# Altium project Proyecto_Receptaculo.PrjPcb
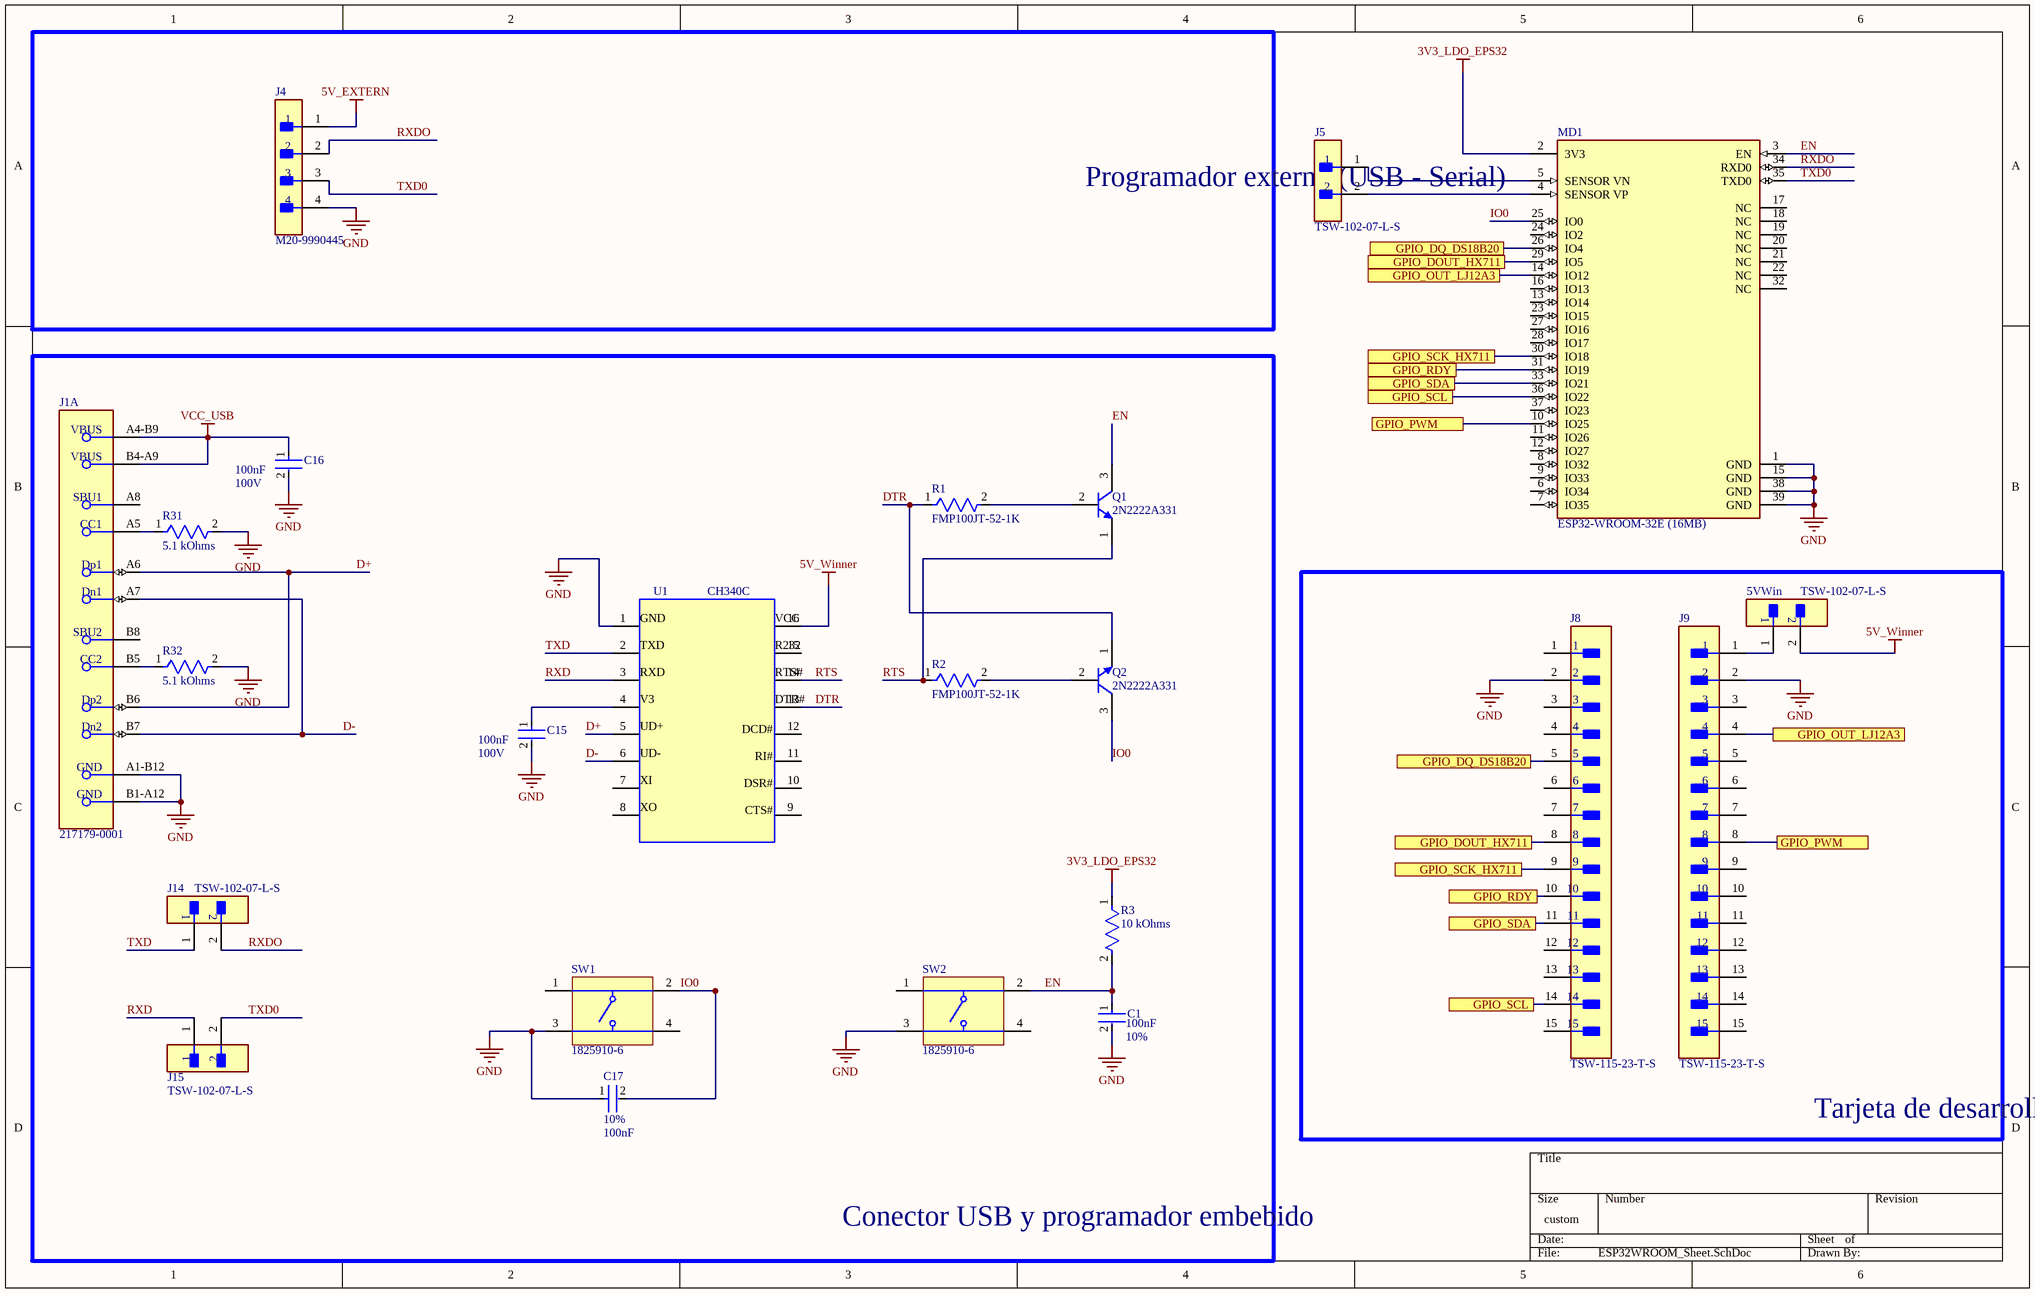
[diagram p0: ESP32WROOM_Sheet.SchDoc]
Title: Alimentacion
5 sheets, 103 parts. Net scope: flat (ports and power ports of the same name join across sheets).
Board file: Proyecto_receptaculo_PCB.PcbDoc
Sheets:
  ESP32WROOM_Sheet.SchDoc
  Alimentacion_Sheet.SchDoc
  Driver_Motor_Sheet.SchDoc
  Sensores_ADCs_Sheet.SchDoc
  Placa_Receptaculo_Gases_Sheet.SchDoc

## Sheet ESP32WROOM_Sheet.SchDoc: ESP32-WROOM-32
size 381 x 241 mm; DocumentNumber: 1; Revision: 1.0; SheetNumber: 1; SheetTotal: 5

### Parts
5VWin  TSW-102-07-L-S  [FP-TSW-102-07-L-S-MFG]
C1  Tolerance: 10%  Capacitance: 100nF  [FP-RDE2M1-MFG]  (hidden comment: RDER72E104K2K1H03B)
C15  Capacitance: 100nF  Voltage Rating (DC): 100V  [FP-RCE1K1-2_5-MFG]  (hidden comment: RCER72A104K1K1H03B)
C16  Capacitance: 100nF  Voltage Rating (DC): 100V  [FP-RCE1K1-2_5-MFG]  (hidden comment: RCER72A104K1K1H03B)
C17  Tolerance: 10%  Capacitance: 100nF  [FP-RDE2M1-MFG]  (hidden comment: RDER72E104K2K1H03B)
J1  217179-0001  [FP-2171790001-MFG]  (part A of 2)
J4  M20-9990445  [FP-M20-9990445-MFG]
J5  TSW-102-07-L-S  [FP-TSW-102-07-L-S-MFG]
J8  TSW-115-23-T-S  [FP-TSW-115-23-T-S-MFG]
J9  TSW-115-23-T-S  [FP-TSW-115-23-T-S-MFG]
J14  TSW-102-07-L-S  [FP-TSW-102-07-L-S-MFG]
J15  TSW-102-07-L-S  [FP-TSW-102-07-L-S-MFG]
MD1  ESP32-WROOM-32E (16MB)  [FP-ESP32-WROOM-32E_16MB-MFG]
Q1  2N2222A331  [TO-92]
Q2  2N2222A331  [TO-92]
R1  FMP100JT-52-1K  [FP-FMP100-MFG]
R2  FMP100JT-52-1K  [FP-FMP100-MFG]
R3  10 kOhms  [FP-FMP100-MFG]
R31  5.1 kOhms  [FP-FMP100-MFG]
R32  5.1 kOhms  [FP-FMP100-MFG]
SW1  1825910-6  [TECO-1825910-6_V]
SW2  1825910-6  [TECO-1825910-6_V]
U1  CH340C  [SOP-16 (SOP127P780X190-16N)]

### Blocks framed on the sheet
Programador externo (USB - Serial): J4
Conector USB y programador embebido: C1 C15-C17 J1 J14 J15 Q1 Q2 R1-R3 R31 R32 SW1 SW2 U1
Tarjeta de desarrollo externa: 5VWin J8 J9

### Ports
GPIO_DOUT_HX711 (see ESP32WROOM_Sheet[5A], Sensores_ADCs_Sheet[3C]), GPIO_DOUT_HX711 (see ESP32WROOM_Sheet[5C], Sensores_ADCs_Sheet[3C]), GPIO_DQ_DS18B20 (see ESP32WROOM_Sheet[5A], Sensores_ADCs_Sheet[4B]), GPIO_DQ_DS18B20 (see ESP32WROOM_Sheet[5C], Sensores_ADCs_Sheet[4B]), GPIO_OUT_LJ12A3 (see ESP32WROOM_Sheet[5A], Sensores_ADCs_Sheet[5B]), GPIO_OUT_LJ12A3 (see ESP32WROOM_Sheet[6C], Sensores_ADCs_Sheet[5B]), GPIO_PWM (see Driver_Motor_Sheet[1C], ESP32WROOM_Sheet[5B]), GPIO_PWM (see Driver_Motor_Sheet[1C], ESP32WROOM_Sheet[6C]), GPIO_RDY (see ESP32WROOM_Sheet[5B], Sensores_ADCs_Sheet[4B]), GPIO_RDY (see ESP32WROOM_Sheet[5C], Sensores_ADCs_Sheet[4B]), GPIO_SCK_HX711 (see ESP32WROOM_Sheet[5B], Sensores_ADCs_Sheet[3C]), GPIO_SCK_HX711 (see ESP32WROOM_Sheet[5C], Sensores_ADCs_Sheet[3C]), GPIO_SCL (see ESP32WROOM_Sheet[5B], Sensores_ADCs_Sheet[4A]), GPIO_SCL (see ESP32WROOM_Sheet[5D], Sensores_ADCs_Sheet[4A]), GPIO_SDA (see ESP32WROOM_Sheet[5B], Sensores_ADCs_Sheet[4A]), GPIO_SDA (see ESP32WROOM_Sheet[5C], Sensores_ADCs_Sheet[4A])

### Nets
3V3_LDO_EPS32: MD1.2(3V3) R3.1
5V_EXTERN: J4.1
5V_Winner: 5VWin.2 U1.16
GND: C1.2 C15.2 C16.2 C17.1 J1.A1-B12(GND) J1.B1-A12(GND) J4.4 J8.2 J9.2 MD1.1(GND) MD1.15(GND) MD1.38(GND) MD1.39(GND) R31.2 R32.2 SW1.3 SW2.3 U1.1
VCC_USB: C16.1 J1.A4-B9(VBUS) J1.B4-A9(VBUS)
D+: J1.A6(Dp1) J1.B6(Dp2) U1.5
D-: J1.A7(Dn1) J1.B7(Dn2) U1.6
DTR: Q2.1(E) R1.1 U1.13
EN: C1.1 MD1.3(EN) Q1.3(C) R3.2 SW2.2
IO0: C17.2 MD1.25(IO0) Q2.3(C) SW1.2
RTS: Q1.1(E) R2.1 U1.14
RXD: J15.1 U1.3
RXDO: J4.2 J14.2 MD1.34(RXD0)
TXD: J14.1 U1.2
TXD0: J4.3 J15.2 MD1.35(TXD0)
Net5VWin_1: 5VWin.1 J9.1
NetC15_1: C15.1 U1.4
NetJ1_A5: J1.A5(CC1) R31.1
NetJ1_B5: J1.B5(CC2) R32.1
NetJ5_1: J5.1 MD1.5(SENSOR_VN)
NetJ5_2: J5.2 MD1.4(SENSOR_VP)
NetJ8_5: J8.5 MD1.26(IO4) ; port GPIO_DQ_DS18B20
NetJ8_8: J8.8 MD1.29(IO5) ; port GPIO_DOUT_HX711
NetJ8_9: J8.9 MD1.30(IO18) ; port GPIO_SCK_HX711
NetJ8_10: J8.10 MD1.31(IO19) ; port GPIO_RDY
NetJ8_11: J8.11 MD1.33(IO21) ; port GPIO_SDA
NetJ8_14: J8.14 MD1.36(IO22) ; port GPIO_SCL
NetJ9_4: J9.4 MD1.14(IO12) ; port GPIO_OUT_LJ12A3
NetJ9_8: J9.8 MD1.10(IO25) ; port GPIO_PWM
NetQ1_2: Q1.2(B) R1.2
NetQ2_2: Q2.2(B) R2.2

Not connected (* = marked no-connect by the designer): J1 A8(SBU1) B8(SBU2); J8 1 3 4 6 7 12 13 15; J9 3 5 6 7 9 10 11 12 13 14 15; MD1 6(IO34) 7(IO35) 8(IO32) 9(IO33) 11(IO26) 12(IO27) 13(IO14) 16(IO13) 17(NC) 18(NC) 19(NC) 20(NC) 21(NC) 22(NC) 23(IO15) 24(IO2) 27(IO16) 28(IO17) 32(NC) 37(IO23); SW1 1 4; SW2 1 4; U1 7 8 9 10 11 12 15

### Notes on the sheet
- (in symbol CH340) GND; VCC; TXD; R232; RXD; RTS#; V3; DTR#; DCD#; UD+; RI#; UD-; DSR#; XI; CTS#; XO

### Library data of the parts
5VWin J5 J14 J15 = CMP-02766-001428-1: CONN HEADER VERT 2POS 2.54MM; Voltage Rating: 550V; Current Rating: 7.6A; Gender: Male; Number of Contacts: 2; Connector Type: Male Pin; Radiation Hardening: No; Orientation: Straight; Contact Plating: Gold; Max Operating Temperature: 125°C; Mount: Through Hole; Package Quantity: 1; Number of Rows: 1; Housing Material: Polyester; RoHS Compliant: Yes; Length: 5.08mm; Max Voltage Rating (AC): 550V; Pitch: 2.54mm; Packaging: Bulk; Depth: 2.54mm; Termination: Solder; Min Operating Temperature: -55°C; Housing Color: Black; Lead Free: Lead Free; Color: Black; Number of Positions: 2; Width: 2.54mm; Max Current Rating: 7.6A; REACH SVHC: No SVHC; Contact Material: Bronze; Contact Mating Length: 0.23inch; Series: TSW; Contact Type: Male Pin
C1 C17 = CMP-06035-020184-1: Ceramic Capacitor 100nF ±10% 250V X7R Radial; Lead/Base Style: Kinked; Lead Diameter: 0.5mm; Lead Pitch: 0.197inch; Dielectric: X7R; Mount: Through Hole; Resistor Type: Ceramic; Height: 4mm; Width: 0.124inch; Length: 5.5mm; Case/Package: Radial; Packaging: Bulk; Max Operating Temperature: 125°C; Voltage Rating (DC): 250V; Package Quantity: 500; Min Operating Temperature: -55°C; Voltage Rating: 250V; Termination: Radial; Height - Seated (Max): 0.236inch; Lead Free: Lead Free
C15 C16 = CMP-06035-011084-1: Cap Ceramic Monolithic 100nF 100V 10% Thru-Hole Bulk; Dielectric: X7R; Lead/Base Style: Formed Leads; Lead Diameter: 0.5mm; Resistor Type: Ceramic; Voltage Rating: 100V; Case/Package: Radial; Packaging: Bulk; Lead Pitch: 0.197inch; Height - Seated (Max): 0.138inch; Mount: Through Hole; Height: 3.5mm; Width: 0.098inch; Termination: Radial; Tolerance: 10%; Min Operating Temperature: -55°C; Package Quantity: 500; Max Operating Temperature: 125°C; Length: 0.157inch; Ratings: AEC-Q200
J1 = CMP-04767-000028-2: CONN RCP USB2.0 TYP C 24P SMD RA; NexarPartId: 117190526; Gender: Receptacle; Number of Contacts: 16; Current Rating: 1.25A; Voltage Rating: 30V; Min Operating Temperature: -40°C; USB Standard: USB 2.0; Height: 3.36mm; Contact Material: Gold, Nickel; Max Operating Temperature: 85°C
J4 = CMP-00671-05399696-1: M20-9990445 Conn Unshrouded Header HDR 4 POS 2.54mm Solder ST Thru-Hole Bulk/Loose; Insulation Resistance: 10GΩ; Connector Type: Male Pin; Voltage Rating (DC): 750V; Max Current Rating: 3A; Contact Resistance: 25mΩ; Number of Contacts: 4; Gender: Male; Color: Black; Height: 2.54mm; Contact Material: Brass, Bronze, Gold, Nickel; Orientation: Straight; Width: 12.7mm; Mount: Through Hole; Pitch: 2.54mm; Lead Pitch: 2.54mm; RoHS: Compliant; Max Operating Temperature: 105°C; Case/Package: SIL; NexarPartId: 5399696; Depth: 2.54mm; Length: 10.16mm; Current Rating: 3A; Contact Plating: Gold; Radiation Hardening: No; Contact Mating Length: 6.096mm; Voltage Rating (AC): 750V; Termination: Solder; REACH SVHC: No SVHC; Weight: 45.359237g; Number of Rows: 1; Min Operating Temperature: -40°C; Housing Material: Nylon; Housing Color: Black; Number of Positions: 4; Number of Pins: 4
J8 J9 = CMP-02766-001466-1: CONN HEADER VERT 15POS 2.54MM; Connector Type: Male Pin; Number of Contacts: 15; Gender: Male; Pitch: 0.1inch; Termination: Solder; Packaging: Bulk; Lead Free: Lead Free; Housing Color: Black; Housing Material: Plastic; Color: Black; RoHS Compliant: Yes; Contact Type: Male Pin; Width: 2.54mm; Mount: Through Hole; Contact Material: Bronze; Number of Rows: 1; Radiation Hardening: No; Number of Positions: 15; Length: 38.1mm; REACH SVHC: No SVHC; Height: 2.54mm; Contact Plating: Tin; Series: TSW; Contact Mating Length: 0.23inch
MD1 = CMP-194065-000027-1: RX TXRX MOD WIFI TRACE ANT SMD
Q1 Q2 = 2N2222A331: Bipolar (Bjt) Single Transistor, Npn, 30 V, 500 Mw, 800 Ma, 100 Rohs Compliant: Yes |Multicomp Pro 2N2222; Body Material: Metal; Collector Emitter Breakdown Voltage: 30V; hFE Min: 30; Max Collector Current: 800mA; Max Power Dissipation: 500mW; Number of Elements: 1; Transition Frequency: 250MHz; Supplier: Newark; Supplier Part Number: 87K2254; Manufacturer: Multicomp; Manufacturer Part Number: 2N2222; RoHS: Compliant; Category: BJTs; Stock: 14638; Pricing: 1=0,685, 10=0,562, 50=0,429, 100=0,379, 500=0,361, 1000=0,311, 5000=0,286, 10000=0,274 (USD); Case/Package: TO-18; Collector Emitter Voltage (VCEO): 30V; Lifecycle Status: Production; Max Operating Temperature: 200°C; Pins: 3; Number of Terminals: 3; Polarity: NPN; Power Dissipation: 500mW; REACH SVHC: No; ComponentLink1URL: https://datasheet.octopart.com:443/2N2222-Multicomp-datasheet-632794.pdf?src-supplier=IHS; ComponentLink1Description: https://datasheet.octopart.com:443/2N2222-Multicomp-datasheet-632794.pdf?src-supplier=IHS; ComponentLink2URL: https://datasheet.octopart.com:443/2N2222-Multicomp-datasheet-12475390.pdf?src-supplier=Newark; ComponentLink2Description: https://datasheet.octopart.com:443/2N2222-Multicomp-datasheet-12475390.pdf?src-supplier=Newark
R1-R3 R31 R32 = CMP-00621-25629781-1: Resistor, 1 kOhm, ± 5%, 1 W, Axial Leaded, Metal Film, High Power Flame Proof; Power Rating: 1W; Resistance: 1kΩ; Temperature Coefficient: 100ppm/°C; Length: 6.3mm; Min Operating Temperature: -55°C; Tolerance: 5%; RoHS: Compliant; Military Standard: Not; Mount: Through Hole; Case/Package: Conformal; Diameter: 2.4mm; Schedule B: 8533210090, 8533210090; Radiation Hardening: No; Lead Free: Lead Free; Composition: Metal Film; Max Operating Temperature: 155°C; Termination: Axial
SW1 SW2 = CMP-1684-00021-1: Tact Switch, SPST-NO, 0.05 A, -35 to 85 degC, 4-Pin THD, RoHS, Bulk; Manufacturer: TE Connectivity; Maximum Contact Resistance: 100mOhm; Mechanical Life: 100000Cycles; Bushing Type: Unthreaded; Switch Configuration: OFF(ON); Maximum DC Voltage Rating: 24V; Contact Rating @ Voltage: 0.05A@24VDC; Actuator Color: Black; Body Orientation: Straight; Function: MomentaryContact; Illumination: N/R; Actuator Style: RoundButton; Actuator Material: PolybutyleneTerephthalate; Dielectric Strength: 500VAC; Pole Throw Configuration: SPST; Actuator Length: 1.4mm; Product Weight: N/A; Contact Material: CopperAlloy; Housing Material: N/A; Terminal Type: PCPins; Minimum Insulation Resistance: 100MOhm; Package Description: 4-Pin Through Hole Device, Body 5.99 x 5.99 mm, Pitch 6.5 mm; Part No: 1825910-6; Package Reference: THD; Base Material: N/A; Manufacturer URL: http://www.te.com; Contact Plating: Silver; RoHS: Yes; Datasheet Version: Rev. C9; Electrical Life: 100000Cycles; Maximum AC Voltage Rating: N/A; Thread Size: N/R; Operating Temperature: -35to85C; Mounting: ThroughHole; Dimension: 5.99x5mm; Datasheet URL: http://www.te.com/commerce/DocumentDelivery/DDEController?Action=showdoc&DocId=Customer+Drawing%7F1825910%7FC9%7Fpdf%7FEnglish%7FENG_CD_1825910_C9.pdf%7F1825910-6; Family: 1825910; Seal Location: N/A; Seal Description: N/A; Packaging: N/A
U1 = CH340: Supply rail voltage, reference to GND pin: -0.5 - 6.5 V; IO pin voltage, reference to GND pin: -0.5 - VCC+0.5 V; Supply rail voltage (5V operation): 4.5 - 5.5 V; Supply rail voltage (3V operation): 3.3 - 3.8 V; Operating current: 12 - 30 mA; Sleeping current (5V operation): 150 - 200 uA; Sleeping current (3V operation): 50 - 80 uA; Low input voltage: -0.5 - 0.7 V; High input voltage: 2.0 - VCC+0.5 V; Low output voltage: 0.5 V; High output voltage: VCC-0.5 V; Internal pull-up strength: 3 - 300 (typ 150) µA; Internal pull-down strength: -50 - -300 (typ -150) µA; Brown-out detector threshold voltage: 2.3 - 2.9 (typ 2.6) V; Clock frequency (at pin XI): 11.98 - 12.02 (typ 12.00) MHz; Power-on reset time: 20 - 50 ms; Operating temperature: -40 - 85 ºC; Storage temperature: -40 - 125 ºC; ComponentLink1Description: datasheet; ComponentLink1URL: https://www.mouser.com/datasheet/2/306/CH340DS1-2487512.pdf?srsltid=AfmBOooaCm0bY9ghGhDfZzr0yr_8N53BDd8jqQWjHYTFMZadGDepO_U8; ComponentLink2Description: Sparkfun module; ComponentLink2URL: https://co.mouser.com/ProductDetail/SparkFun/DEV-15096?qs=l7cgNqFNU1ix43QyKol73A%3D%3D

## Sheet Alimentacion_Sheet.SchDoc: Alimentacion
size 381 x 241 mm; Date: 13-10-2025; Author: Gerson T.& Lotfi D.; DrawnBy: NPI; Organization: Universidad Distrital Francisco José de Caldas; DocumentNumber: 2; Revision: 1.0; SheetNumber: 2; SheetTotal: 5; Time: 13:44
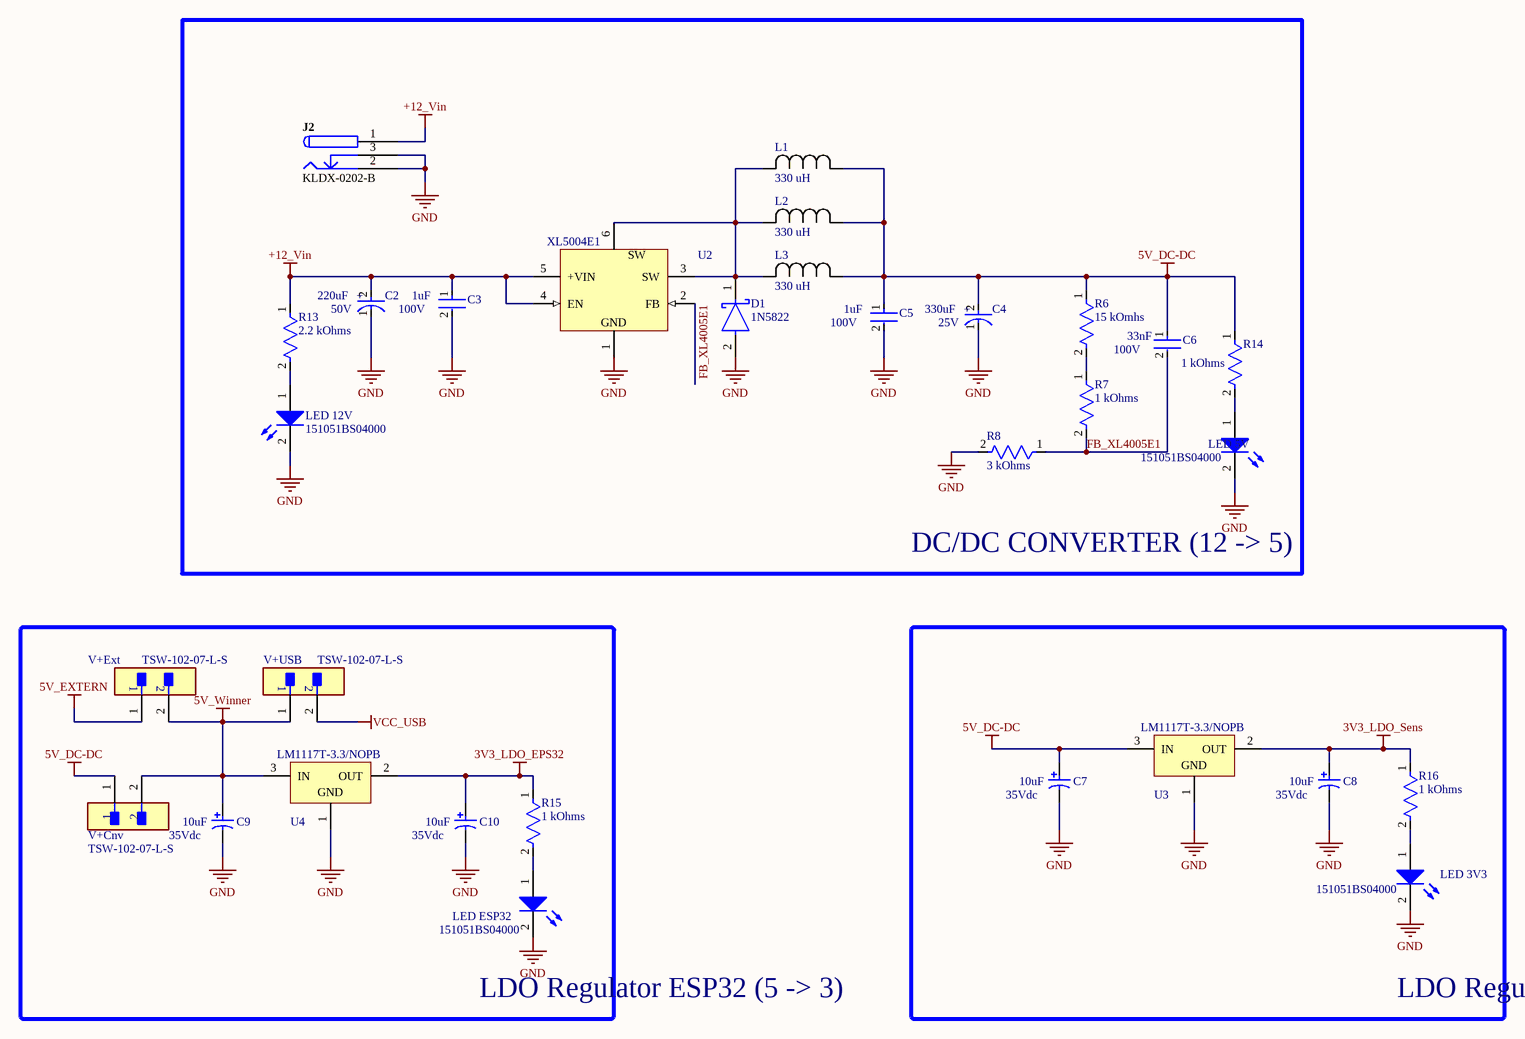
[diagram p1: Alimentacion_Sheet.SchDoc]

### Parts
C2  Voltage Rating: 50V  Capacitance: 220uF  [FP-RAD-TH-D_10_0_5-L_16_1-MFG]  (hidden comment: EEUFR1H221B)
C3  Voltage Rating: 100V  Capacitance: 1uF  [FP-RCE2A2-MFG]  (hidden comment: RCER72A105K2A2H03B)
C4  Voltage Rating (DC): 25V  Capacitance: 330uF  [FP-RAD-TH-D_8_0_5-L_11_5-MFG]  (hidden comment: EEUHD1E331)
C5  Voltage Rating: 100V  Capacitance: 1uF  [FP-RCE2A2-MFG]  (hidden comment: RCER72A105K2A2H03B)
C6  Voltage Rating: 100V  Capacitance: 33nF  [FP-RCE1K1-2_5-MFG]  (hidden comment: RCER72A333K1M1H03A)
C7  Voltage: 35Vdc  Capacitance Value: 10uF  [KEMT-T352_E_V]  (hidden comment: T352E475K035AT)
C8  Voltage: 35Vdc  Capacitance Value: 10uF  [KEMT-T352_E_V]  (hidden comment: T352E475K035AT)
C9  Voltage: 35Vdc  Capacitance Value: 10uF  [KEMT-T352_E_V]  (hidden comment: T352E475K035AT)
C10  Voltage: 35Vdc  Capacitance Value: 10uF  [KEMT-T352_E_V]  (hidden comment: T352E475K035AT)
D1  1N5822  [FP-DO-201AD-MFG]
J2  KLDX-0202-B  [KYCN-KLDX-0202-B_V]
L1  330 uH  [IND_BOURNS_RLB0608]
L2  330 uH  [IND_BOURNS_RLB0608]
L3  330 uH  [IND_BOURNS_RLB0608]
LED_3V3  151051BS04000  [WL-TMRC_D5.9H8.7]
LED_5V  151051BS04000  [WL-TMRC_D5.9H8.7]
LED_12V  151051BS04000  [WL-TMRC_D5.9H8.7]
LED_ESP32  151051BS04000  [WL-TMRC_D5.9H8.7]
R6  15 kOmhs  [FP-FMP100-MFG]
R7  1 kOhms  [FP-FMP100-MFG]
R8  3 kOhms  [FP-FMP100-MFG]
R13  2.2 kOhms  [FP-FMP100-MFG]
R14  1 kOhms  [FP-FMP100-MFG]
R15  1 kOhms  [FP-FMP100-MFG]
R16  1 kOhms  [FP-FMP100-MFG]
U2  XL5004E1  [RO263-5L]
U3  LM1117T-3.3/NOPB  [NDE0003A]
U4  LM1117T-3.3/NOPB  [NDE0003A]
V+Cnv  TSW-102-07-L-S  [FP-TSW-102-07-L-S-MFG]
V+Ext  TSW-102-07-L-S  [FP-TSW-102-07-L-S-MFG]
V+USB  TSW-102-07-L-S  [FP-TSW-102-07-L-S-MFG]

### Blocks framed on the sheet
DC/DC CONVERTER (12 -> 5): C2-C6 D1 J2 L1-L3 LED_5V LED_12V R6-R8 R13 R14 U2
LDO Regulator ESP32 (5 -> 3): C9 C10 LED_ESP32 R15 U4 V+Cnv V+Ext V+USB
LDO Regulator Sensors (5 ->3): C7 C8 LED_3V3 R16 U3

### Nets
3V3_LDO_EPS32: C10.1 R15.1 U4.2(OUT)
3V3_LDO_Sens: C8.1 R16.1 U3.2(OUT)
5V_DC-DC: C4.2(A) C5.1 C6.1 C7.1 L1.1 L2.1 L3.1 R6.1 R14.1 U3.3(IN) V+Cnv.1
5V_EXTERN: V+Ext.1
5V_Winner: C9.1 U4.3(IN) V+Cnv.2 V+Ext.2 V+USB.1
+12_Vin: C2.2(A) C3.1 J2.1 R13.1 U2.4(EN) U2.5(+VIN)
GND: C2.1(C) C3.2 C4.1(C) C5.2 C7.2 C8.2 C9.2 C10.2 D1.2(A) J2.2 J2.3 LED_3V3.2(K) LED_5V.2(K) LED_12V.2(K) LED_ESP32.2(K) R8.2 U2.1(GND) U3.1(GND) U4.1(GND)
VCC_USB: V+USB.2
FB_XL4005E1: C6.2 R7.2 R8.1 U2.2(FB)
NetD1_1: D1.1(C) L1.2 L2.2 L3.2 U2.3(SW) U2.6(SW)
NetLED_3V3_1: LED_3V3.1(A) R16.2
NetLED_5V_1: LED_5V.1(A) R14.2
NetLED_12V_1: LED_12V.1(A) R13.2
NetLED_ESP32_1: LED_ESP32.1(A) R15.2
NetR6_2: R6.2 R7.1

### Notes on the sheet
- (in symbol CMP-05427-000403-1) +
- (in symbol CMP-05427-001780-1) +

### Library data of the parts
C2 = CMP-05427-000403-1: Aluminum Electrolytic Capacitors (Radial Lead Type) 220uF ±20% 50V; ESR (Equivalent Series Resistance): 30mR; Ripple Current: 1.65A; Lead Diameter: 0.6mm; Life (Hours): 8000Hour; Height: 16mm; Min Operating Temperature: -40°C; Lead Pitch: 5mm; Diameter: 10mm; Features: General Purpose; Tolerance: 20%; Mount: Through Hole; Number of Pins: 2; Series: FR; Max Operating Temperature: 105°C; Contact Plating: Tin; Impedance: 30mR; Length: 16mm; Package Quantity: 1; RoHS Compliant: Yes; Lead Free: Lead Free; Packaging: Ammo Pack; Radiation Hardening: No; Termination: Radial; Voltage Rating (DC): 50V; Case/Package: Radial; REACH SVHC: No SVHC; Height - Seated (Max): 0.689inch
C3 C5 = CMP-06035-004838-1: Cap Ceramic 1uF 100V X7R ±10% Radial 2.5mm +125°C Automotive Bulk; Lead Diameter: 0.5mm; Lead/Base Style: Straight; Height: 4mm; Tolerance: 10%; Ratings: AEC-Q200; Packaging: Bulk; Max Operating Temperature: 125°C; Package Quantity: 500; Case/Package: Radial; Min Operating Temperature: -55°C; Resistor Type: Ceramic; Lead Pitch: 0.098inch; Height - Seated (Max): 0.157inch; Length: 0.217inch; Width: 0.124inch; Termination: Radial; Mount: Through Hole; Dielectric: X7R; Voltage Rating (DC): 100V
C4 = CMP-05427-001780-1: Aluminum Electrolytic Capacitors (Radial Lead Type) AEC-Q200 Qualified 330uF ±20% 25V; Lead/Base Style: Straight; Lead Diameter: 0.6mm; Polarity: Polar; Ripple Current (AC): 310mA; Life (Hours): 1000Hour; Termination: Radial; Construction: RADIAL; Diameter: 8mm; Tolerance: 20%; Series: Automotive, AEC-Q200, HD; Min Operating Temperature: -55°C; REACH SVHC: No SVHC; Length: 11.5mm; Case/Package: Radial; RoHS Compliant: Yes; Voltage: 25V; Packaging: Bulk; Height - Seated (Max): 0.512inch; Ripple Current: 310mA; Number of Pins: 2; Max Operating Temperature: 105°C; Voltage Rating: 25V; Lead Pitch: 3.5mm; Package Quantity: 200; Mount: Through Hole; Height: 11.5mm
C6 = CMP-06035-020669-1: Cap Ceramic Monolithic 33nF 100V 10% Thru-Hole Bulk; Lead Diameter: 0.5mm; Lead/Base Style: Formed Leads; Dielectric: X7R; Height: 3.5mm; Height - Seated (Max): 0.138inch; Ratings: AEC-Q200; Mount: Through Hole; Length: 0.157inch; Max Operating Temperature: 125°C; Lead Pitch: 0.197inch; Resistor Type: Ceramic; Termination: Radial; Package Quantity: 2000; Width: 0.098inch; Packaging: Tape and Reel; Case/Package: Radial; Tolerance: 10%; Min Operating Temperature: -55°C; Voltage Rating (DC): 100V
C7-C10 = CMP-2000-07185-1: Capacitor, Tantalum, Radial, Solid Tantalum, Conformal, Dipped, 4.7 uF, +/- 10%, 35 V, -55 to 125 degC, 2-Pin THD (T352), RoHS, Bulk; Manufacturer: KEMET; Product Height: 11.7(Max)mm; Lead Pitch For Radial: 5.08mm; Product Diameter: 5.5(Max)mm; Voltage Rating DC: 35V; Package Description: 2-Pin Through Hole Device, Body 5.5 x 0.5 mm, Height 11.7 mm; Manufacturer URL: http://www.kemet.com/; Operating Temperature: -55to125°C; Packaging: Bulk; Category: CapacitorTantalumSolidRadial; Case Style: Dipped; PartNumber: T352E475K035AT; Maximum Operating Temperature: 125°C; Tolerance: 10%; Minimum Operating Temperature: -55°C; Mounting Technology: ThroughHole; Package Reference: T352; Datasheet Version: 05/2016; Datasheet URL: http://capacitoredge.kemet.com/capedge2/DataSheet/Datasheet-T352E475K035AT.pdf?pn=T352E475K035AT; Package URL: http://capacitoredge.kemet.com/capedge2/DataSheet/Datasheet-T352E475K035AT.pdf?pn=T352E475K035AT
D1 = CMP-12187-000025-1: DIODE SCHOTTKY 40V 3A DO201AD; Manufacturer: STMicroelectronics; Max Junction Temp: +150°C; Peak Reverse Current: 2mA; Max Surge Forward Current: 80A; Temperature Range High: +150°C; Automotive: No; RoHS: TRUE; ComponentLink2Description: Datasheet; Manufacturer Part Number: 1N5822; Lead Free: Yes; Octopart: https://octopart.com/1n5822-stmicroelectronics-323225; Device Class L2: Diodes; Max Repetitive Reverse Voltage: 40V; Temperature: to +150°C; Height: 5.3mm; Category: Diode; Digikey Description: DIODE SCHOTTKY 40V 3A DO201AD; ComponentLink2URL: https://www.st.com/resource/en/datasheet/1n5822.pdf; Device Class L3: Schottky Diodes; Device Class L1: Discrete Semiconductors; Forward Current: 3A; Mouser Description: Schottky Diodes & Rectifiers Vr/40V Io/3A BULK; Package: DO-201AD
J2 = CMP-0256-00001-1: 3 Conductor Power Jack, 2 break 2 aux contacts; ComponentLink2URL: http://anacapa.kycon.com/Catalog_PDF/KLDX_0202.pdf; PackageReference: KLDX-0202-B; Contact Finish: Brass; ComponentLink2Description: Datasheet; Mounting Technology: Through Hole; PackageDescription: Jack, 9 x 14.5 mm Body, 2.5 mm Center Pin Diameter; ComponentLink1Description: Manufacturer URL; PartNumber: KLDX-0202-B; ComponentLink1URL: http://kycon.com/
L1-L3 = RLB0608-1R8ML: No Description Available; Manufacturer_Name: Bourns Electronics; Copyright: Copyright (C) 2025 Ultra Librarian. All rights reserved.; Manufacturer_Part_Number: RLB0608-1R8ML
LED_3V3 LED_5V LED_12V LED_ESP32 = CMP-1488-00009-2: NexarPartId: 29717812; Test Current: 20mA; Forward Voltage: 3.2V; Wavelength: 470nm; Lens Size: 5mm; Lens Style: Circular, Diffused, Round; Forward Current: 100mA; Peak Wavelength: 465nm; Viewing Angle: 40°; Luminous Intensity: 500mcd; Max Reverse Voltage (DC): 5V; Case/Package: Radial; Width: 5mm; Mount: Through Hole; Min Operating Temperature: -40°C; Length: 5mm; Height: 8.6mm; Max Operating Temperature: 85°C; Packaging: Bulk; Color: Blue; RoHS: Compliant; REACH SVHC: Unknown; Dominant Wavelength: 470nm
R6-R8 R13-R16 = CMP-00621-25629781-1: as R1 on sheet ESP32WROOM_Sheet; Length: 6.3mm; Min Operating Temperature: -55°C; Tolerance: 5%; RoHS: Compliant; Military Standard: Not; Mount: Through Hole; Case/Package: Conformal; Diameter: 2.4mm; Schedule B: 8533210090, 8533210090; Radiation Hardening: No; Lead Free: Lead Free; Composition: Metal Film; Max Operating Temperature: 155°C; Termination: Axial
U2 = XL5004E1: Input Voltage Range: Wide 5V to 32V; Output Adjustable: from 0.8V to 30V; Maximum Duty Cycle: 100%; Minimum Drop Out: 0.6V; Output Current Capability: 5A Constant; Feedback Voltage: 0.776 - 0.824 (typ 0.8) V; Efficiency: 90 %; Shutdown Supply Current: 60 - 200 uA; Quiescent Supply Current: 3 - 5 mA; Switch Current Limit: 8 A; Switching Frequency: Fixed 300KHz; ComponentLink1Description: Suplier; ComponentLink1URL: https://www.lcsc.com/product-detail/C73332.html?s_z=n_xl4005; ComponentLink2Description: datasheet (1); ComponentLink2URL: https://www.lcsc.com/datasheet/C73332.pdf; ComponentLink3Description: datasheet (2); ComponentLink3URL: https://www.sigmaelectronica.net/wp-content/uploads/2022/11/XL4005-XLSEMI.pdf; ComponentLink4Description: datasheet (3); ComponentLink4URL: https://www.alldatasheet.es/datasheet-pdf/view/763182/ETC2/XL4005E1.html
U3 U4 = CMP-0062-02494-3: 800mA Low-Dropout Linear Regulator, 3-pin TO-220, Pb-Free; Manufacturer: Texas Instruments; PackageTopMarking: NSUZXYTTE#*LM1117T*3.3; PowerWise: N; CompType: LDO IC; RoHS: Y; ComponentLink1URL: http://www.ti.com/general/docs/lit/getliterature.tsp?genericPartNumber=LM1117-N&fileType=pdf; PackageReference: NDE0003A; PinCount: 3; ComponentLink1Description: Datasheet URL; PackageDescription: TO-220, Molded, 3 Lead, Straight
V+Cnv V+Ext V+USB = CMP-02766-001428-1: as 5VWin on sheet ESP32WROOM_Sheet; Radiation Hardening: No; Orientation: Straight; Contact Plating: Gold; Max Operating Temperature: 125°C; Mount: Through Hole; Package Quantity: 1; Number of Rows: 1; Housing Material: Polyester; RoHS Compliant: Yes; Length: 5.08mm; Max Voltage Rating (AC): 550V; Pitch: 2.54mm; Packaging: Bulk; Depth: 2.54mm; Termination: Solder; Min Operating Temperature: -55°C; Housing Color: Black; Lead Free: Lead Free; Color: Black; Number of Positions: 2; Width: 2.54mm; Max Current Rating: 7.6A; REACH SVHC: No SVHC; Contact Material: Bronze; Contact Mating Length: 0.23inch; Series: TSW; Contact Type: Male Pin

## Sheet Driver_Motor_Sheet.SchDoc: Driver_Motor
size A4; Date: 13/10/2025; Author: Gerson T.& Lotfi D.; Organization: Universidad Distrital Francisco José de Caldas; DocumentNumber: 3; Revision: 1.0; SheetNumber: 3; SheetTotal: 4; Time: 16:49
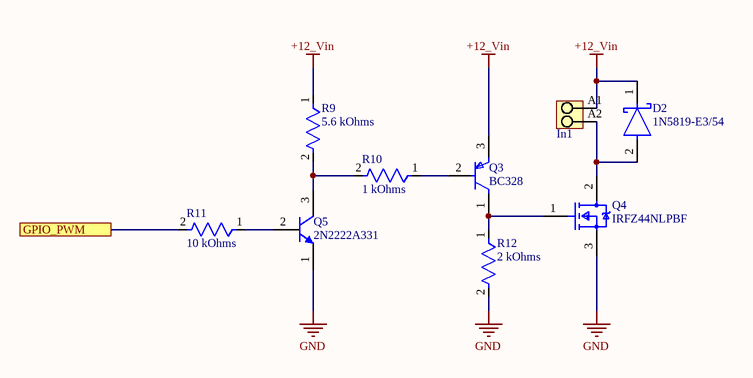
[diagram p2: Driver_Motor_Sheet.SchDoc]

### Parts
D2  1N5819-E3/54  [FP-1N5819-E3-54-MFG]
In1  1715310000  [LM_5_00_90_02]  (value not drawn)
Q3  BC328  [TO-92]
Q4  IRFZ44NLPBF  [FP-PG-TO262-3-MFG]
Q5  2N2222A331  [TO-92]
R9  5.6 kOhms  [FP-FMP100-MFG]
R10  1 kOhms  [FP-FMP100-MFG]
R11  10 kOhms  [FP-FMP100-MFG]
R12  2 kOhms  [FP-FMP100-MFG]

### Ports
GPIO_PWM (see ESP32WROOM_Sheet[5B])

### Nets
+12_Vin: D2.1(C) In1.A1 Q3.3(C) R9.1
GND: Q4.3(S) Q5.1(E) R12.2
NetD2_2: D2.2(A) In1.A2 Q4.2(D)
NetJ9_8: R11.2 ; port GPIO_PWM
NetQ3_1: Q3.1(E) Q4.1(G) R12.1
NetQ3_2: Q3.2(B) R10.1
NetQ5_2: Q5.2(B) R11.1
NetQ5_3: Q5.3(C) R9.2 R10.2

### Library data of the parts
D2 = CMP-02539-000037-2: DIODE SCHOTTKY 40V 1A DO204AL; Capacitance: 110pF; Element Configuration: Single; Peak Non-Repetitive Surge Current: 25A; Forward Voltage: 900mV; Polarity: Standard; Peak Reverse Current: 1mA; Max Operating Temperature: 125°C; Forward Current: 1A; Package Quantity: 1; Average Rectified Current: 1A; Voltage: 40V; Radiation Hardening: No; Current: 1A; Max Reverse Voltage (DC): 40V; Height: 2.7mm; Output Current: 1A; Lead Free: Lead Free; Diameter: 2.7mm; Min Operating Temperature: -65°C; Max Repetitive Reverse Voltage (Vrrm): 40V; Number of Pins: 2; Width: 2.7mm; Length: 5.2mm; Current Rating: 1A; Packaging: Tape and Reel; Mount: Through Hole; Max Forward Surge Current (Ifsm): 25A; Voltage Rating (DC): 40V
In1 = CMP-1559-01745-1: OMNIMATE Signal - series LM; Manufacturer: Weidmueller; Contact_material: Cu-Leg; Contact_surface: tinned; Solder_pin_length_mm: 3,5 mm; Rated_voltage_for_surge_voltage_class_pollution_degree_II_2: 630 V; Short_text_for_material: LM 5.00/02/90 3.5SN OR BX; Pitch_inch: 0,197 inch; Pitch_mm: 5 mm; Wire_cross_section_AWG_min_UL_1059: AWG 24; No_of_poles: 2; Side_termination_characteristic: closed side; UL_94_flammability_rating: V-0; Mounting_onto_the_PCB: Solder connection; Rated_voltage_use_group_B_UL_1059: 300 V; Insulating_material: Wemid (PA); Solid_min_H05_07_V_U: 0,2 mm²; Rated_current_use_group_B_UL_1059: 15 A; Wire_cross_section_AWG_max_UL_1059: AWG 14; Solid_max_H05_07_V_U: 2,5 mm²; PartNumber: 1715310000; ComponentLink2Description: URL Link1; Revision: V1; ComponentLink1Description: Manufacturer URL; ComponentLink2URL: http://catalog.weidmueller.com/catalog/Start.do?localeId=en&ObjectID=1715310000; PackageReference: LM_5_00_90_02; Qty: 500 PCS; Colour: Orange; ComponentLink1URL: http://www.weidmueller.com/; Packaging: Box
Q3 = BC328: Collector Base Voltage: - 30 V; Collector Emitter Voltage: - 25 V; Emitter Base Voltage: - 5 V; Collector Current: - 800 mA; Peak Collector Current: - 1 A; Total Power Dissipation: 625 mW; Junction Temperature: 150 °C; DC Current Gain: 100 - 630; Collector Base Cutoff Current: - 100 nA; Collector Emitter Saturation Voltage: - 0.7 V; Base Emitter On Voltage: - 1.2 V; Gain Bandwidth Product: 100 MH; Collector Base Capacitance: 12 pF; Storage Temperature Range: - 55 to + 150 °C; Collector Base Breakdown Voltage: - 30 V; Collector Emitter Breakdown Voltage: - 25 V; Emitter Base Breakdown Voltage: - 5 V; ComponentLink1Description: Suplier; ComponentLink1URL: https://co.mouser.com/ProductDetail/onsemi-Fairchild/BC328?qs=UMEuL5FsraCayeUWgO8mfw%3D%3D&srsltid=AfmBOorf5xZwroEOplrd7QqiXYxDeoimh0FrK1nMyUL-RBvrlmJFWC5R; ComponentLink2Description: Datasheet (1); ComponentLink2URL: https://www.mouser.com/catalog/specsheets/fairchild%20semiconductor_bc327.pdf?_gl=1*1ayinll*_gcl_au*MTU3NTQyMTg3NS4xNzU3MzcyNzA1LjE4NDA3OTc0MTAuMTc2MDM4ODMxNC4xNzYwMzg4NDM1*_ga*MTE1MjgxNTUzOS4xNzU3MzcyNzA3*_ga_15W4STQT4T*czE3NjAzOTI0MjgkbzEyJGcxJHQxNzYwMzkzNzQyJGo2MCRsMCRoMA..; ComponentLink3Description: datasheet (2); ComponentLink3URL: https://www.alldatasheet.es/datasheet-pdf/view/281199/SEMTECH_ELEC/BC328.html
Q4 = CMP-00196-65874408-1: IRFZ44NLPBF Single N-Channel 55 V 17.5 mOhm 63 nC HEXFET® Power Mosfet - TO-262; Resistance: 17.5MΩ; Turn-On Delay Time: 12ns; Drain to Source Breakdown Voltage: 55V; Threshold Voltage: 4V; Rise Time: 60ns; Input Capacitance: 1.47nF; Power Dissipation: 110W; Max Junction Temperature (Tj): 175°C; Gate to Source Voltage (Vgs): 20V; Number of Channels: 1; Fall Time: 45ns; Max Power Dissipation: 3.8W; Continuous Drain Current (ID): 49A; Turn-Off Delay Time: 44ns; Case/Package: TO-262; Lifecycle Status: Production; Packaging: Bulk; RoHS: Compliant; Radiation Hardening: No; Height: 9.65mm; Voltage Rating (DC): 55V; On-State Resistance: 17.5mΩ; Width: 4.826mm; Mount: Through Hole; Max Operating Temperature: 175°C; Schedule B: 8541290080, 8541290080; Termination: Through Hole; Dual Supply Voltage: 55V; Package Quantity: 1000; Min Operating Temperature: -55°C; Lead Free: Contains Lead, Lead Free; Drain to Source Voltage (Vdss): 55V; Element Configuration: Single; Length: 10.668mm; Rds On Max: 17.5mΩ; Number of Pins: 3; Current Rating: 49A; REACH SVHC: No SVHC; Drain to Source Resistance: 17.5mΩ; NexarPartId: 65874408; Number of Elements: 1; Nominal Vgs: 4V
Q5 = 2N2222A331: as Q1 on sheet ESP32WROOM_Sheet; Supplier: Newark; Supplier Part Number: 87K2254; Manufacturer: Multicomp; Manufacturer Part Number: 2N2222; RoHS: Compliant; Category: BJTs; Stock: 14638; Pricing: 1=0,685, 10=0,562, 50=0,429, 100=0,379, 500=0,361, 1000=0,311, 5000=0,286, 10000=0,274 (USD); Case/Package: TO-18; Collector Emitter Voltage (VCEO): 30V; Lifecycle Status: Production; Max Operating Temperature: 200°C; Pins: 3; Number of Terminals: 3; Polarity: NPN; Power Dissipation: 500mW; REACH SVHC: No; ComponentLink1URL: https://datasheet.octopart.com:443/2N2222-Multicomp-datasheet-632794.pdf?src-supplier=IHS; ComponentLink1Description: https://datasheet.octopart.com:443/2N2222-Multicomp-datasheet-632794.pdf?src-supplier=IHS; ComponentLink2URL: https://datasheet.octopart.com:443/2N2222-Multicomp-datasheet-12475390.pdf?src-supplier=Newark; ComponentLink2Description: https://datasheet.octopart.com:443/2N2222-Multicomp-datasheet-12475390.pdf?src-supplier=Newark
R9-R12 = CMP-00621-25629781-1: as R1 on sheet ESP32WROOM_Sheet; Length: 6.3mm; Min Operating Temperature: -55°C; Tolerance: 5%; RoHS: Compliant; Military Standard: Not; Mount: Through Hole; Case/Package: Conformal; Diameter: 2.4mm; Schedule B: 8533210090, 8533210090; Radiation Hardening: No; Lead Free: Lead Free; Composition: Metal Film; Max Operating Temperature: 155°C; Termination: Axial

## Sheet Sensores_ADCs_Sheet.SchDoc: Sensores y ADCs
size 381 x 241 mm; Date: 13/10/2025; Author: Gerson T.& Lotfi D.; Organization: Universidad Distrital Francisco José de Caldas; DocumentNumber: 4; Revision: 1.0; SheetNumber: 4; SheetTotal: 5; Time: 19:25
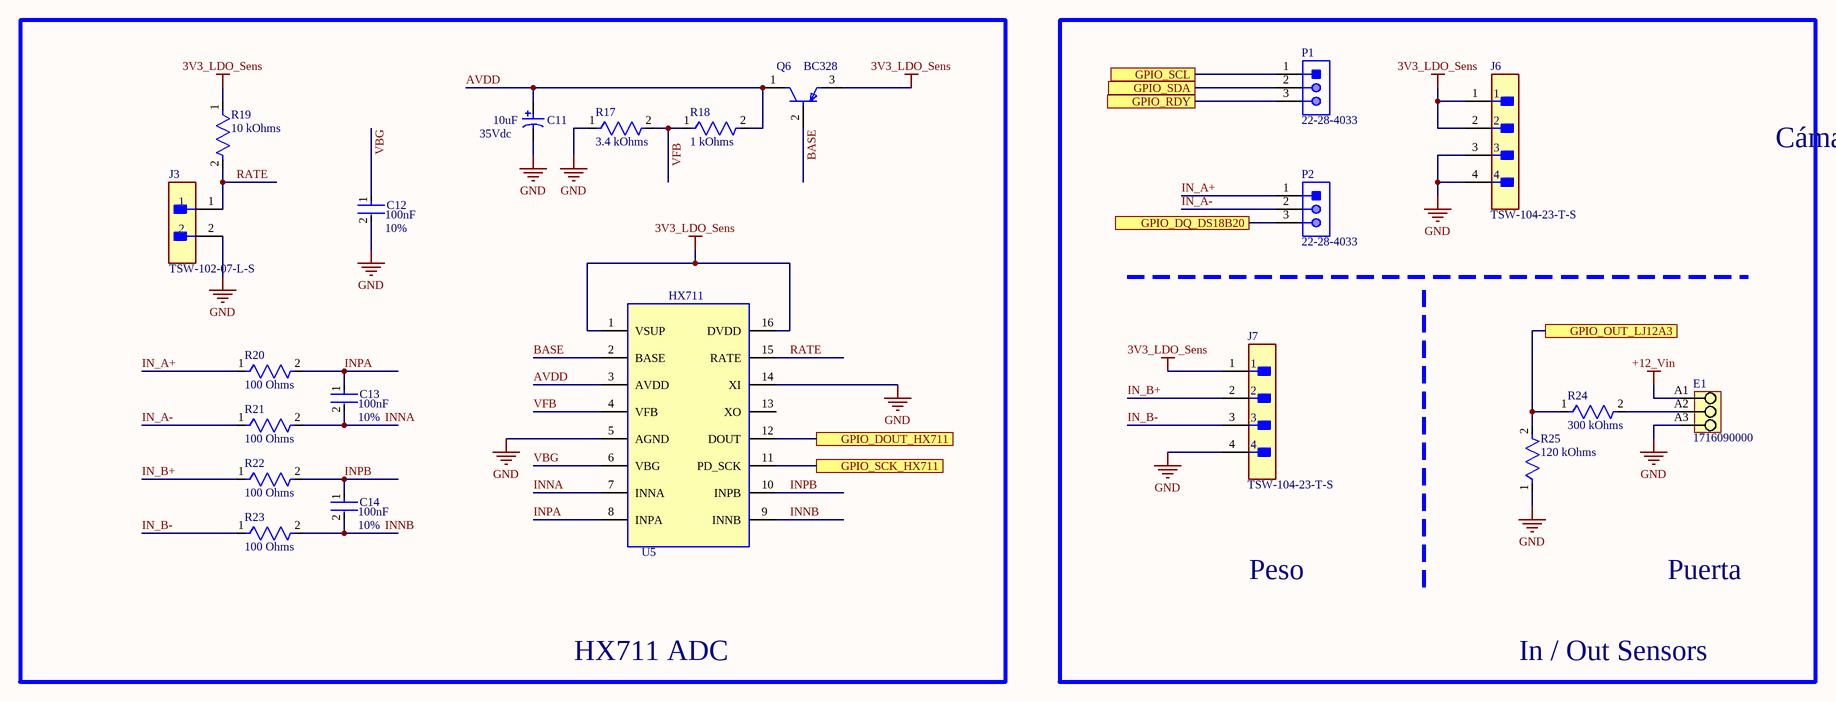
[diagram p3: Sensores_ADCs_Sheet.SchDoc]

### Parts
C11  Voltage: 35Vdc  Capacitance Value: 10uF  [KEMT-T352_E_V]  (hidden comment: T352E475K035AT)
C12  Tolerance: 10%  Capacitance: 100nF  [FP-RDE2M1-MFG]  (hidden comment: RDER72E104K2K1H03B)
C13  Tolerance: 10%  Capacitance: 100nF  [FP-RDE2M1-MFG]  (hidden comment: RDER72E104K2K1H03B)
C14  Tolerance: 10%  Capacitance: 100nF  [FP-RDE2M1-MFG]  (hidden comment: RDER72E104K2K1H03B)
E1  1716090000  [LM_5_08_90_03]
J3  TSW-102-07-L-S  [FP-TSW-102-07-L-S-MFG]
J6  TSW-104-23-T-S  [FP-TSW-104-23-T-S-MFG]
J7  TSW-104-23-T-S  [FP-TSW-104-23-T-S-MFG]
P1  22-28-4033  [MOLX-22-28-4033_V]
P2  22-28-4033  [MOLX-22-28-4033_V]
Q6  BC328  [TO-92]
R17  3.4 kOhms  [FP-FMP100-MFG]
R18  1 kOhms  [FP-FMP100-MFG]
R19  10 kOhms  [FP-FMP100-MFG]
R20  100 Ohms  [FP-FMP100-MFG]
R21  100 Ohms  [FP-FMP100-MFG]
R22  100 Ohms  [FP-FMP100-MFG]
R23  100 Ohms  [FP-FMP100-MFG]
R24  300 kOhms  [FP-FMP100-MFG]
R25  120 kOhms  [FP-FMP100-MFG]
U5  HX711  [SOP-16L (SOP127P600-8N)]

### Blocks framed on the sheet
HX711 ADC: C11-C14 J3 Q6 R17-R23 U5

### Ports
GPIO_DOUT_HX711 (see ESP32WROOM_Sheet[5A], ESP32WROOM_Sheet[5C]), GPIO_DQ_DS18B20 (see ESP32WROOM_Sheet[5A], ESP32WROOM_Sheet[5C]), GPIO_OUT_LJ12A3 (see ESP32WROOM_Sheet[5A], ESP32WROOM_Sheet[6C]), GPIO_RDY (see ESP32WROOM_Sheet[5B], ESP32WROOM_Sheet[5C]), GPIO_SCK_HX711 (see ESP32WROOM_Sheet[5B], ESP32WROOM_Sheet[5C]), GPIO_SCL (see ESP32WROOM_Sheet[5B], ESP32WROOM_Sheet[5D]), GPIO_SDA (see ESP32WROOM_Sheet[5B], ESP32WROOM_Sheet[5C])

### Nets
3V3_LDO_Sens: J6.1 J6.2 J7.1 Q6.3(C) R19.1 U5.1(VSUP) U5.16(DVDD)
+12_Vin: E1.A1
GND: C11.2 C12.2 E1.A3 J3.2 J6.3 J6.4 J7.4 R17.1 R25.1 U5.5(AGND) U5.14(XI)
AVDD: C11.1 Q6.1(E) R18.2 U5.3(AVDD)
BASE: Q6.2(B) U5.2(BASE)
IN_A+: P2.1 R20.1
IN_A-: P2.2 R21.1
IN_B+: J7.2 R22.1
IN_B-: J7.3 R23.1
INNA: C13.2 R21.2 U5.7(INNA)
INNB: C14.2 R23.2 U5.9(INNB)
INPA: C13.1 R20.2 U5.8(INPA)
INPB: C14.1 R22.2 U5.10(INPB)
RATE: J3.1 R19.2 U5.15(RATE)
VBG: C12.1 U5.6(VBG)
VFB: R17.2 R18.1 U5.4(VFB)
NetE1_A2: E1.A2 R24.2
NetJ8_5: P2.3 ; port GPIO_DQ_DS18B20
NetJ8_8: U5.12(DOUT) ; port GPIO_DOUT_HX711
NetJ8_9: U5.11(PD_SCK) ; port GPIO_SCK_HX711
NetJ8_10: P1.3 ; port GPIO_RDY
NetJ8_11: P1.2 ; port GPIO_SDA
NetJ8_14: P1.1 ; port GPIO_SCL
NetJ9_4: R24.1 R25.2 ; port GPIO_OUT_LJ12A3

Not connected (* = marked no-connect by the designer): U5 13(XO)

### Notes on the sheet
- Cámara de gases
- Peso
- Puerta
- In / Out Sensors

### Library data of the parts
C11 = CMP-2000-07185-1: as C7 on sheet Alimentacion_Sheet; Package Description: 2-Pin Through Hole Device, Body 5.5 x 0.5 mm, Height 11.7 mm; Manufacturer URL: http://www.kemet.com/; Operating Temperature: -55to125°C; Packaging: Bulk; Category: CapacitorTantalumSolidRadial; Case Style: Dipped; PartNumber: T352E475K035AT; Maximum Operating Temperature: 125°C; Tolerance: 10%; Minimum Operating Temperature: -55°C; Mounting Technology: ThroughHole; Package Reference: T352; Datasheet Version: 05/2016; Datasheet URL: http://capacitoredge.kemet.com/capedge2/DataSheet/Datasheet-T352E475K035AT.pdf?pn=T352E475K035AT; Package URL: http://capacitoredge.kemet.com/capedge2/DataSheet/Datasheet-T352E475K035AT.pdf?pn=T352E475K035AT
C12-C14 = CMP-06035-020184-1: as C1 on sheet ESP32WROOM_Sheet; Lead Pitch: 0.197inch; Dielectric: X7R; Mount: Through Hole; Resistor Type: Ceramic; Height: 4mm; Width: 0.124inch; Length: 5.5mm; Case/Package: Radial; Packaging: Bulk; Max Operating Temperature: 125°C; Voltage Rating (DC): 250V; Package Quantity: 500; Min Operating Temperature: -55°C; Voltage Rating: 250V; Termination: Radial; Height - Seated (Max): 0.236inch; Lead Free: Lead Free
E1 = CMP-1559-01768-1: OMNIMATE Signal - series LM; Manufacturer: Weidmueller; Contact_surface: tinned; Pitch_mm: 5,08 mm; Solder_pin_length_mm: 3,5 mm; Contact_material: Cu-Leg; Wire_cross_section_AWG_min_UL_1059: AWG 24; Solid_min_H05_07_V_U: 0,2 mm²; Insulating_material: Wemid (PA); Solid_max_H05_07_V_U: 2,5 mm²; Pitch_inch: 0,2 inch; Wire_cross_section_AWG_max_UL_1059: AWG 14; UL_94_flammability_rating: V-0; No_of_poles: 3; Rated_voltage_use_group_B_UL_1059: 300 V; Mounting_onto_the_PCB: Solder connection; Side_termination_characteristic: closed side; Short_text_for_material: LM 5.08/03/90 3.5SN OR BX; Rated_current_use_group_B_UL_1059: 15 A; Rated_voltage_for_surge_voltage_class_pollution_degree_II_2: 630 V; Revision: V1; ComponentLink2URL: http://catalog.weidmueller.com/catalog/Start.do?localeId=en&ObjectID=1716090000; Colour: Orange; PackageReference: LM_5_08_90_03; ComponentLink1Description: Manufacturer URL; ComponentLink2Description: URL Link1; ComponentLink1URL: http://www.weidmueller.com/; Qty: 500 PCS; PartNumber: 1716090000; Packaging: Box
J3 = CMP-02766-001428-1: as 5VWin on sheet ESP32WROOM_Sheet; Radiation Hardening: No; Orientation: Straight; Contact Plating: Gold; Max Operating Temperature: 125°C; Mount: Through Hole; Package Quantity: 1; Number of Rows: 1; Housing Material: Polyester; RoHS Compliant: Yes; Length: 5.08mm; Max Voltage Rating (AC): 550V; Pitch: 2.54mm; Packaging: Bulk; Depth: 2.54mm; Termination: Solder; Min Operating Temperature: -55°C; Housing Color: Black; Lead Free: Lead Free; Color: Black; Number of Positions: 2; Width: 2.54mm; Max Current Rating: 7.6A; REACH SVHC: No SVHC; Contact Material: Bronze; Contact Mating Length: 0.23inch; Series: TSW; Contact Type: Male Pin
J6 J7 = CMP-02766-001388-1: CONN HEADER VERT 4POS 2.54MM; Number of Contacts: 4; Gender: Male; Connector Type: Male Pin; Max Voltage Rating (AC): 550V; Max Current Rating: 7.6A; Radiation Hardening: No; Lead Free: Lead Free; RoHS Compliant: Yes; Contact Material: Bronze; Number of Positions: 4; Housing Color: Black; Min Operating Temperature: -55°C; Mount: Through Hole; Number of Rows: 1; Orientation: Straight; Contact Mating Length: 0.23inch; Contact Type: Male Pin; REACH SVHC: No SVHC; Max Operating Temperature: 105°C; Color: Black; Pitch: 2.54mm; Length: 10.16mm; Series: TSW; Packaging: Bulk; Contact Plating: Tin; Package Quantity: 1; Termination: Solder; Housing Material: Polyester; Width: 2.54mm; Depth: 2.54mm
P1 P2 = CMP-1676-00001-5: Male Header, Pitch 2.54 mm, 1 x 3 Position, Height 8.38 mm, Tail Length 3.18 mm, RoHS, Bulk; Manufacturer: Molex; Rows: 1; Voltage Rating: 250 V; Current Rating: 4 A; Min Operating Temperature: 0 degC; Lead Pitch: 0.1 inch; Packaging: Bulk; Contact Finish: Gold; RoHSCompliant: true; Contact Material: Brass; PackageReference: 22-28-4033; REACH SVHC: Unknown; PackageDescription: Male Header, Pitch 2.54 mm, 1 x 3 Position, Height 8.38 mm, Tail Length 3.18 mm; ComponentLink2URL: http://www.molex.com/pdm_docs/sd/022284033_sd.pdf; Height: 8.38 mm; Mounting Technology: Through Hole; ComponentLink1Description: Manufacturer URL; Length: 7.62 mm; Mount: Through Hole; DatasheetVersion: Rev. G, 01/2012; Max Operating Temperature: 75 degC; ComponentLink2Description: Datasheet; Colour: Black; Pins: 3; Contact Plating: Gold; Package Quantity: 1; ComponentLink1URL: http://www.molex.com/
Q6 = BC328: as Q3 on sheet Driver_Motor_Sheet; Storage Temperature Range: - 55 to + 150 °C; Collector Base Breakdown Voltage: - 30 V; Collector Emitter Breakdown Voltage: - 25 V; Emitter Base Breakdown Voltage: - 5 V; ComponentLink1Description: Suplier; ComponentLink1URL: https://co.mouser.com/ProductDetail/onsemi-Fairchild/BC328?qs=UMEuL5FsraCayeUWgO8mfw%3D%3D&srsltid=AfmBOorf5xZwroEOplrd7QqiXYxDeoimh0FrK1nMyUL-RBvrlmJFWC5R; ComponentLink2Description: Datasheet (1); ComponentLink2URL: https://www.mouser.com/catalog/specsheets/fairchild%20semiconductor_bc327.pdf?_gl=1*1ayinll*_gcl_au*MTU3NTQyMTg3NS4xNzU3MzcyNzA1LjE4NDA3OTc0MTAuMTc2MDM4ODMxNC4xNzYwMzg4NDM1*_ga*MTE1MjgxNTUzOS4xNzU3MzcyNzA3*_ga_15W4STQT4T*czE3NjAzOTI0MjgkbzEyJGcxJHQxNzYwMzkzNzQyJGo2MCRsMCRoMA..; ComponentLink3Description: datasheet (2); ComponentLink3URL: https://www.alldatasheet.es/datasheet-pdf/view/281199/SEMTECH_ELEC/BC328.html
R17-R25 = CMP-00621-25629781-1: as R1 on sheet ESP32WROOM_Sheet; Length: 6.3mm; Min Operating Temperature: -55°C; Tolerance: 5%; RoHS: Compliant; Military Standard: Not; Mount: Through Hole; Case/Package: Conformal; Diameter: 2.4mm; Schedule B: 8533210090, 8533210090; Radiation Hardening: No; Lead Free: Lead Free; Composition: Metal Film; Max Operating Temperature: 155°C; Termination: Axial
U5 = HX711: differential input channels: Two selectable; PGA with selectable gain: 32, 64 and 128 8On-chip active low noise ); Full scale differential input range: ±0.5(AVDD/GAIN)V; Common mode input: AGND+1.2 - AVDD-1.3 V; Output data rate: 10, 80 Hz; Output data coding: 2’s complement (800000 - 7FFFFF HEX); Output settling time (RATE = 0): 400 ms; Output settling time (RATE = DVDD): 50 ms; Input offset drift (Gain = 128): 0.2 mV; Input offset drift (Gain = 64): 0.4 mV; Input noise (Gain = 128，RATE = 0): 50 nV (rms); Input noise (Gain = 128，RATE = DVDD): 90 nV (rms); Temperature drift (Input offset[Gain = 128]): ±6 nV/°C; Temperature drift (Gain [Gain = 128]): ±5 nV/°C; Input common mode rejection (Gain = 128，RATE = 0): 100 dB; Reference bypass: 1.25 V; Crystal or external clock frequency: 1 - 20 (typ 11.0592) MHz; Power supply voltage (DVDD, AVDD, VSUP): 2.6 - 5.5 V; Analog supply current (including regulator): Normal 1400 uA; Power down 0.3 uA; Digital supply current: Normal 100 uA; Power down 0.2 uA; supply rejection: Simultaneous 50 and 60Hz; Operation temperature range: -40 ~ +85°C; Power supply rejection (Gain = 128，RATE = 0): 100 dB; ComponentLink1Description: Suplier; ComponentLink1URL: https://www.lcsc.com/product-detail/C6705483.html?s_z=n_hx711; ComponentLink2Description: datasheet; ComponentLink2URL: https://www.lcsc.com/datasheet/C6705483.pdf

## Sheet Placa_Receptaculo_Gases_Sheet.SchDoc: Placa receptáculo gases
size 381 x 241 mm; Date: 19/10/2025; Author: Gerson T.& Lotfi D.; Organization: Universidad Distrital Francisco José de Caldas; DocumentNumber: 5; Revision: 1.0; SheetNumber: 5; SheetTotal: 5; Time: 16:24
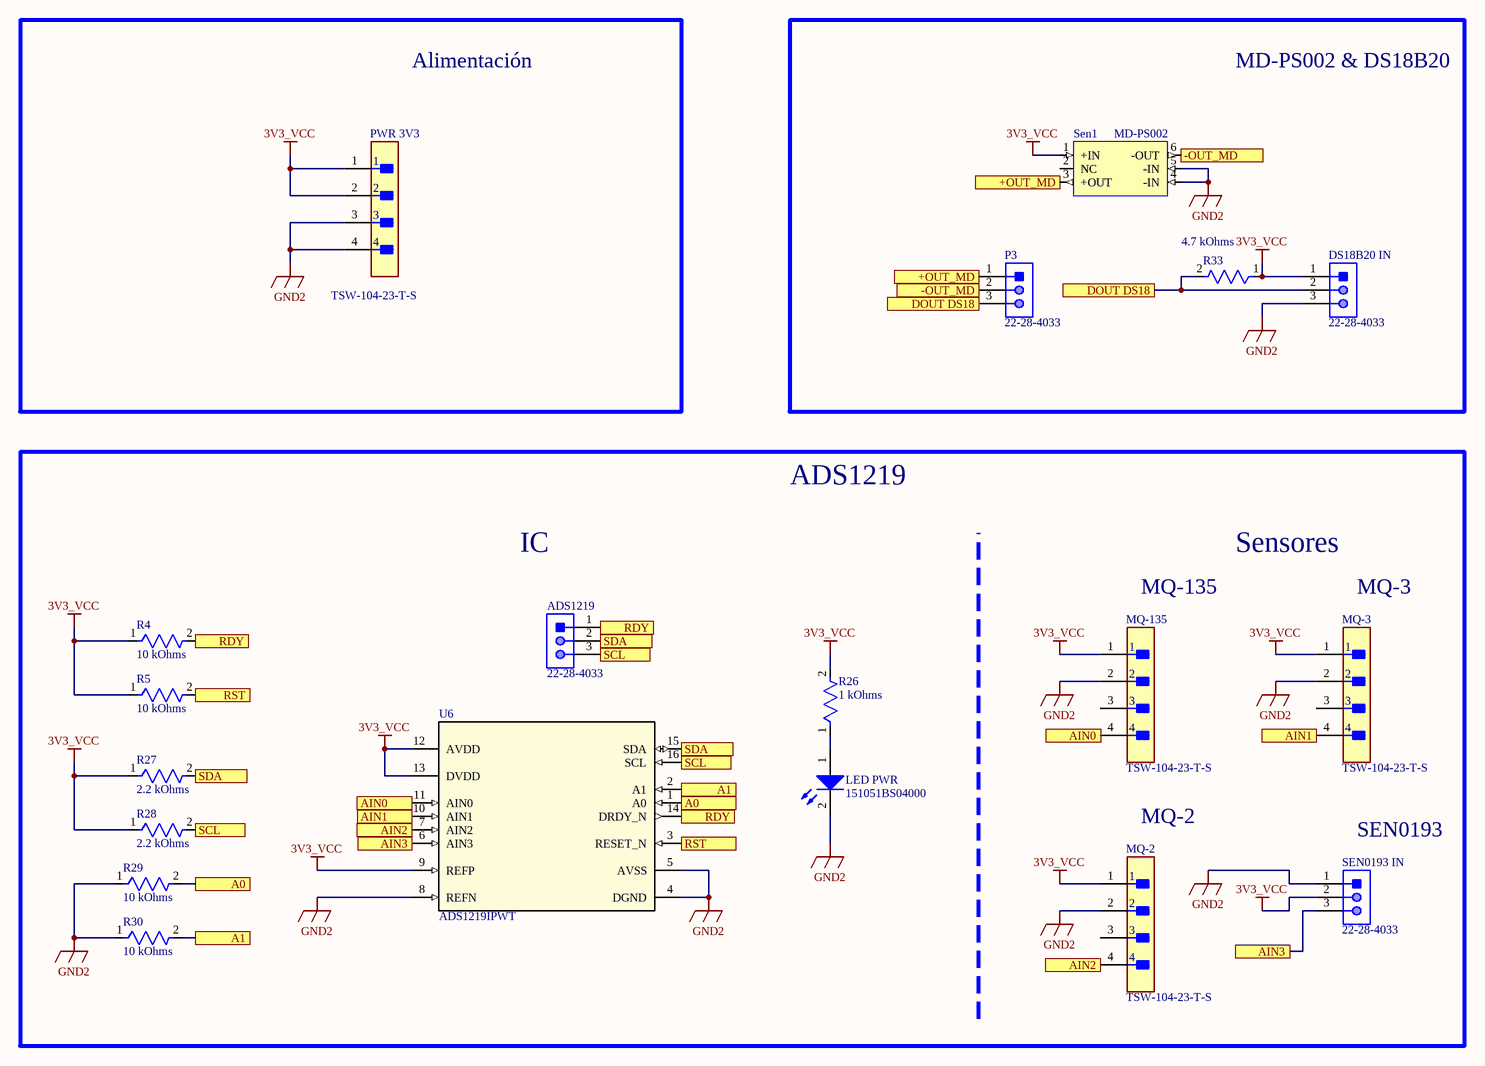
[diagram p4: Placa_Receptaculo_Gases_Sheet.SchDoc]

### Parts
ADS1219  22-28-4033  [MOLX-22-28-4033_V]
DS18B20_IN  22-28-4033  [MOLX-22-28-4033_V]
LED_PWR  151051BS04000  [WL-TMRC_D5.9H8.7]
MQ-2  TSW-104-23-T-S  [FP-TSW-104-23-T-S-MFG]
MQ-3  TSW-104-23-T-S  [FP-TSW-104-23-T-S-MFG]
MQ-135  TSW-104-23-T-S  [FP-TSW-104-23-T-S-MFG]
P3  22-28-4033  [MOLX-22-28-4033_V]
PWR_3V3  TSW-104-23-T-S  [FP-TSW-104-23-T-S-MFG]
R4  10 kOhms  [FP-FMP100-MFG]
R5  10 kOhms  [FP-FMP100-MFG]
R26  1 kOhms  [FP-FMP100-MFG]
R27  2.2 kOhms  [FP-FMP100-MFG]
R28  2.2 kOhms  [FP-FMP100-MFG]
R29  10 kOhms  [FP-FMP100-MFG]
R30  10 kOhms  [FP-FMP100-MFG]
R33  4.7 kOhms  [FP-FMP100-MFG]
Sen1  MD-PS002  [SPO-6 (MD-PS002)]
SEN0193_IN  22-28-4033  [MOLX-22-28-4033_V]
U6  ADS1219IPWT  [PW0016A_N]

### Blocks framed on the sheet
Alimentación: PWR_3V3
MD-PS002 & DS18B20: DS18B20_IN P3 R33 Sen1

### Ports
+OUT_MD (see Placa_Receptaculo_Gases_Sheet[4A]), +OUT_MD (see Placa_Receptaculo_Gases_Sheet[4B]), -OUT_MD (see Placa_Receptaculo_Gases_Sheet[4B]), -OUT_MD (see Placa_Receptaculo_Gases_Sheet[5A]), A0 (see Placa_Receptaculo_Gases_Sheet[2C]), A0 (see Placa_Receptaculo_Gases_Sheet[3C]), A1 (see Placa_Receptaculo_Gases_Sheet[2D]), A1 (see Placa_Receptaculo_Gases_Sheet[3C]), AIN0 (see Placa_Receptaculo_Gases_Sheet[2C]), AIN0 (see Placa_Receptaculo_Gases_Sheet[4C]), AIN1 (see Placa_Receptaculo_Gases_Sheet[2C]), AIN1 (see Placa_Receptaculo_Gases_Sheet[5C]), AIN2 (see Placa_Receptaculo_Gases_Sheet[2C]), AIN2 (see Placa_Receptaculo_Gases_Sheet[4D]), AIN3 (see Placa_Receptaculo_Gases_Sheet[2C]), AIN3 (see Placa_Receptaculo_Gases_Sheet[5D]), DOUT DS18 (see Placa_Receptaculo_Gases_Sheet[4B]), RDY (see Placa_Receptaculo_Gases_Sheet[2C], Placa_Receptaculo_Gases_Sheet[3C]), RDY (see Placa_Receptaculo_Gases_Sheet[3C]), RST (see Placa_Receptaculo_Gases_Sheet[2C]), RST (see Placa_Receptaculo_Gases_Sheet[3C]), SCL (see Placa_Receptaculo_Gases_Sheet[2C], Placa_Receptaculo_Gases_Sheet[3C]), SCL (see Placa_Receptaculo_Gases_Sheet[3C]), SDA (see Placa_Receptaculo_Gases_Sheet[2C], Placa_Receptaculo_Gases_Sheet[3C]), SDA (see Placa_Receptaculo_Gases_Sheet[3C])

### Nets
3V3_VCC: DS18B20_IN.1 MQ-2.1 MQ-3.1 MQ-135.1 PWR_3V3.1 PWR_3V3.2 R4.1 R5.1 R26.2 R27.1 R28.1 R33.1 Sen1.1(+IN) SEN0193_IN.2 U6.9(REFP) U6.12(AVDD) U6.13(DVDD)
GND2: DS18B20_IN.3 LED_PWR.2(K) MQ-2.2 MQ-3.2 MQ-135.2 PWR_3V3.3 PWR_3V3.4 R29.1 R30.1 Sen1.4(-IN) Sen1.5(-IN) SEN0193_IN.1 U6.4(DGND) U6.5(AVSS) U6.8(REFN)
NetADS1219_1: ADS1219.1 R4.2 U6.14(DRDY_N) ; port RDY
NetADS1219_2: ADS1219.2 R27.2 U6.15(SDA) ; port SDA
NetADS1219_3: ADS1219.3 R28.2 U6.16(SCL) ; port SCL
NetDS18B20_IN_2: DS18B20_IN.2 P3.3 R33.2 ; port DOUT DS18
NetLED_PWR_1: LED_PWR.1(A) R26.1
NetMQ-2_4: MQ-2.4 U6.7(AIN2) ; port AIN2
NetMQ-3_4: MQ-3.4 U6.10(AIN1) ; port AIN1
NetMQ-135_4: MQ-135.4 U6.11(AIN0) ; port AIN0
NetP3_1: P3.1 Sen1.3(+OUT) ; port +OUT_MD
NetP3_2: P3.2 Sen1.6(-OUT) ; port -OUT_MD
NetR5_2: R5.2 U6.3(RESET_N) ; port RST
NetR29_2: R29.2 U6.1(A0) ; port A0
NetR30_2: R30.2 U6.2(A1) ; port A1
NetSEN0193_IN_3: SEN0193_IN.3 U6.6(AIN3) ; port AIN3

Not connected (* = marked no-connect by the designer): MQ-2 3; MQ-3 3; MQ-135 3; Sen1 2(NC)

### Notes on the sheet
- ADS1219
- IC
- Sensores
- MQ-135
- MQ-3
- MQ-2
- (near SEN0193_IN) SEN0193

### Library data of the parts
ADS1219 P3 SEN0193_IN = CMP-1676-00001-5: as P1 on sheet Sensores_ADCs_Sheet; Min Operating Temperature: 0 degC; Lead Pitch: 0.1 inch; Packaging: Bulk; Contact Finish: Gold; RoHSCompliant: true; Contact Material: Brass; PackageReference: 22-28-4033; REACH SVHC: Unknown; PackageDescription: Male Header, Pitch 2.54 mm, 1 x 3 Position, Height 8.38 mm, Tail Length 3.18 mm; ComponentLink2URL: http://www.molex.com/pdm_docs/sd/022284033_sd.pdf; Height: 8.38 mm; Mounting Technology: Through Hole; ComponentLink1Description: Manufacturer URL; Length: 7.62 mm; Mount: Through Hole; DatasheetVersion: Rev. G, 01/2012; Max Operating Temperature: 75 degC; ComponentLink2Description: Datasheet; Colour: Black; Pins: 3; Contact Plating: Gold; Package Quantity: 1; ComponentLink1URL: http://www.molex.com/
DS18B20_IN = CMP-1676-00001-5: Male Header, Pitch 2.54 mm, 1 x 3 Position, Height 8.38 mm, Tail Length 3.18 mm, RoHS, Bulk; Manufacturer: Molex; Rows: 1; Voltage Rating: 250 V; Current Rating: 4 A; Colour: Black; Min Operating Temperature: 0 degC; Lead Pitch: 0.1 inch; Packaging: Bulk; Contact Finish: Gold; RoHSCompliant: true; Contact Material: Brass; PackageReference: 22-28-4033; REACH SVHC: Unknown; PackageDescription: Male Header, Pitch 2.54 mm, 1 x 3 Position, Height 8.38 mm, Tail Length 3.18 mm; ComponentLink2URL: http://www.molex.com/pdm_docs/sd/022284033_sd.pdf; Height: 8.38 mm; Mounting Technology: Through Hole; ComponentLink1Description: Manufacturer URL; Length: 7.62 mm; Mount: Through Hole; DatasheetVersion: Rev. G, 01/2012; Max Operating Temperature: 75 degC; ComponentLink2Description: Datasheet; Pins: 3; Contact Plating: Gold; Package Quantity: 1; ComponentLink1URL: http://www.molex.com/
LED_PWR = CMP-1488-00009-2: as LED_3V3 on sheet Alimentacion_Sheet; Case/Package: Radial; Width: 5mm; Mount: Through Hole; Min Operating Temperature: -40°C; Length: 5mm; Height: 8.6mm; Max Operating Temperature: 85°C; Packaging: Bulk; Color: Blue; RoHS: Compliant; REACH SVHC: Unknown; Dominant Wavelength: 470nm
MQ-2 MQ-3 MQ-135 PWR_3V3 = CMP-02766-001388-1: as J6 on sheet Sensores_ADCs_Sheet; Radiation Hardening: No; Lead Free: Lead Free; RoHS Compliant: Yes; Contact Material: Bronze; Number of Positions: 4; Housing Color: Black; Min Operating Temperature: -55°C; Mount: Through Hole; Number of Rows: 1; Orientation: Straight; Contact Mating Length: 0.23inch; Contact Type: Male Pin; REACH SVHC: No SVHC; Max Operating Temperature: 105°C; Color: Black; Pitch: 2.54mm; Length: 10.16mm; Series: TSW; Packaging: Bulk; Contact Plating: Tin; Package Quantity: 1; Termination: Solder; Housing Material: Polyester; Width: 2.54mm; Depth: 2.54mm
R4 R5 R26-R30 R33 = CMP-00621-25629781-1: as R1 on sheet ESP32WROOM_Sheet; Length: 6.3mm; Min Operating Temperature: -55°C; Tolerance: 5%; RoHS: Compliant; Military Standard: Not; Mount: Through Hole; Case/Package: Conformal; Diameter: 2.4mm; Schedule B: 8533210090, 8533210090; Radiation Hardening: No; Lead Free: Lead Free; Composition: Metal Film; Max Operating Temperature: 155°C; Termination: Axial
Sen1 = MD-PS002: Absolute pressure sensor; Pressure: 150 KPa; Topology: wheatstone bridge; ComponentLink2Description: datasheet; ComponentLink2URL: https://electronperdido.com/wp-content/uploads/2021/12/MD_PS002-Datasheet.zh-CN.en_.pdf; ComponentLink3Description: suplier; ComponentLink3URL: https://www.mactronica.com.co/sensor-de-presion-absoluta-md-ps002?srsltid=AfmBOorZAiXsJNmkeTgQPVhJ-_m5m52EX53D2zdWt7F5gRHtJGt4LCYa
U6 = ADS1219IPWT: 24-bit, 1kSPS, 4-ch general-purpose delta-sigma ADC with I2C interface and external Vref inputs 16-TSSOP -40 to 125; Manufacturer_Name: Texas Instruments; TYPE: TYPE; RefDes: RefDes; Copyright: Copyright (C) 2025 Ultra Librarian. All rights reserved.; Manufacturer_Part_Number: ADS1219IPWT; Datasheet: https://www.ti.com/lit/gpn/ads1219

## Nets that join several sheets
3V3_LDO_EPS32: ESP32WROOM_Sheet (MD1.2 R3.1), Alimentacion_Sheet (C10.1 R15.1 U4.2)
3V3_LDO_Sens: Alimentacion_Sheet (C8.1 R16.1 U3.2), Sensores_ADCs_Sheet (7 pins)
5V_EXTERN: ESP32WROOM_Sheet (J4.1), Alimentacion_Sheet (V+Ext.1)
5V_Winner: ESP32WROOM_Sheet (5VWin.2 U1.16), Alimentacion_Sheet (5 pins)
+12_Vin: Alimentacion_Sheet (6 pins), Driver_Motor_Sheet (D2.1 In1.A1 Q3.3 R9.1), Sensores_ADCs_Sheet (E1.A1)
GND: ESP32WROOM_Sheet (18 pins), Alimentacion_Sheet (19 pins), Driver_Motor_Sheet (Q4.3 Q5.1 R12.2), Sensores_ADCs_Sheet (11 pins)
VCC_USB: ESP32WROOM_Sheet (C16.1 J1.A4-B9 J1.B4-A9), Alimentacion_Sheet (V+USB.2)
NetJ8_5: ESP32WROOM_Sheet (J8.5 MD1.26), Sensores_ADCs_Sheet (P2.3)
NetJ8_8: ESP32WROOM_Sheet (J8.8 MD1.29), Sensores_ADCs_Sheet (U5.12)
NetJ8_9: ESP32WROOM_Sheet (J8.9 MD1.30), Sensores_ADCs_Sheet (U5.11)
NetJ8_10: ESP32WROOM_Sheet (J8.10 MD1.31), Sensores_ADCs_Sheet (P1.3)
NetJ8_11: ESP32WROOM_Sheet (J8.11 MD1.33), Sensores_ADCs_Sheet (P1.2)
NetJ8_14: ESP32WROOM_Sheet (J8.14 MD1.36), Sensores_ADCs_Sheet (P1.1)
NetJ9_4: ESP32WROOM_Sheet (J9.4 MD1.14), Sensores_ADCs_Sheet (R24.1 R25.2)
NetJ9_8: ESP32WROOM_Sheet (J9.8 MD1.10), Driver_Motor_Sheet (R11.2)